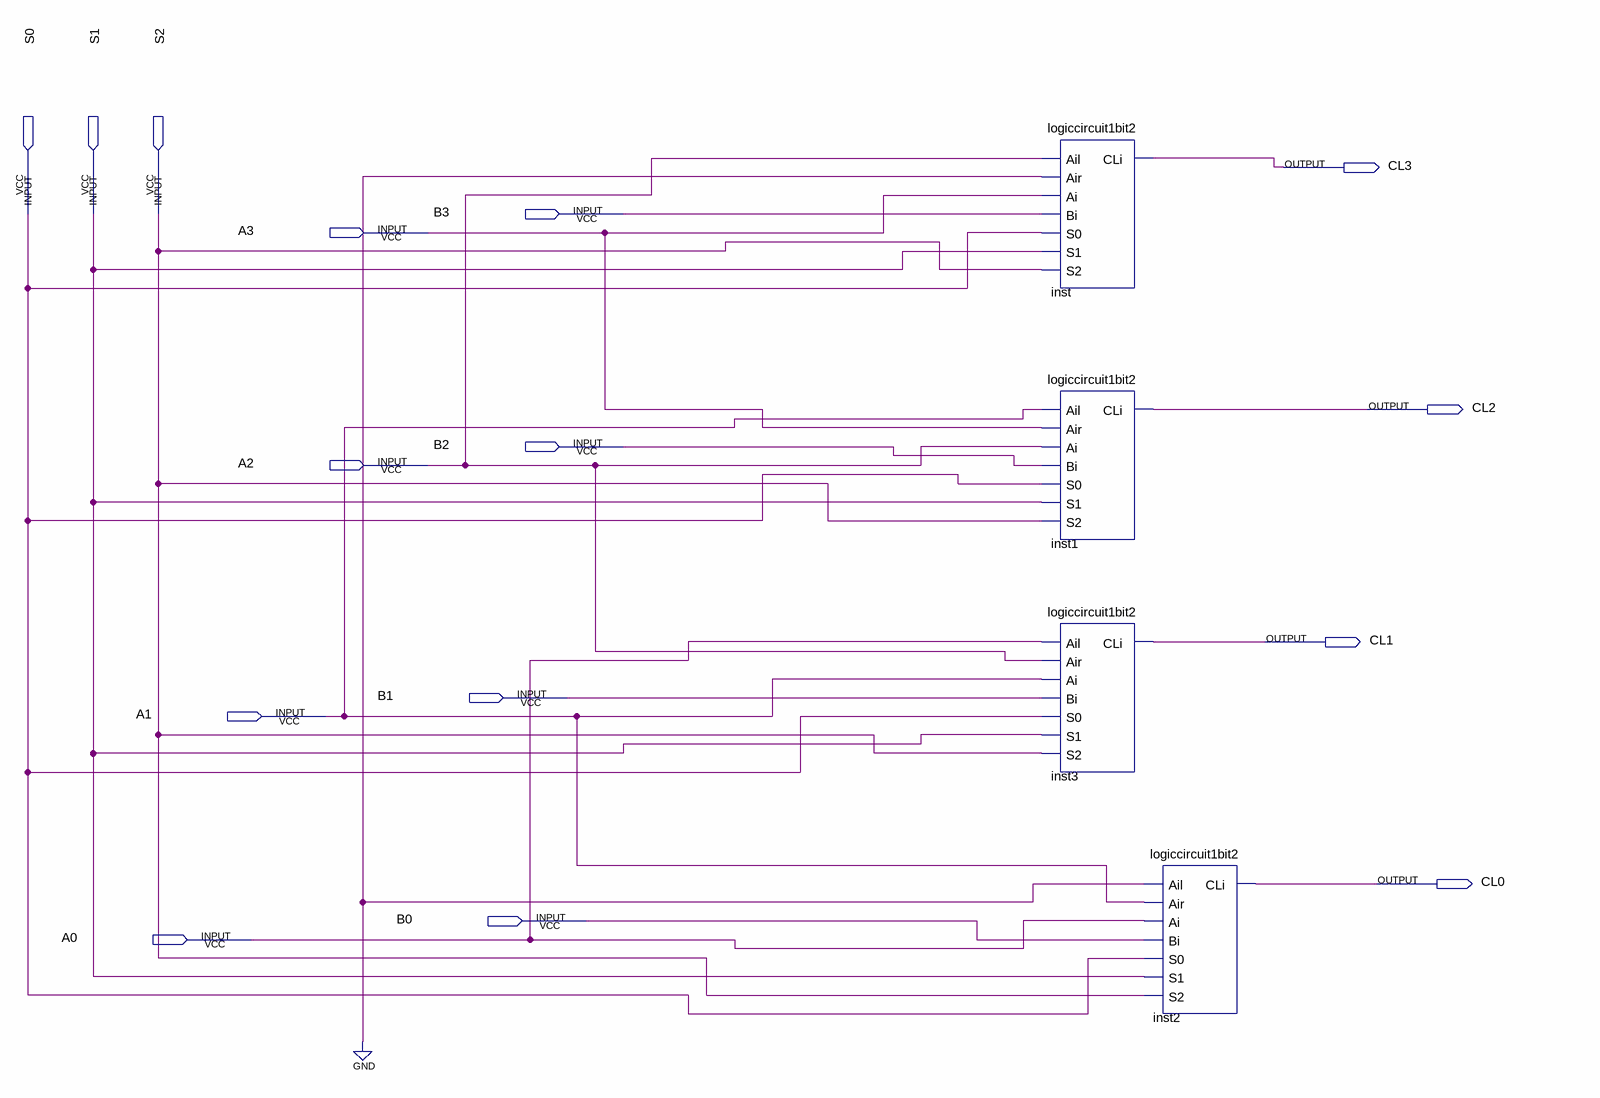
[diagram p0: schematic sheet]
// Quartus schematic logiccircuit4bits.bdf as structural Verilog: 4 symbols, 15 pins
module logiccircuit4bits (
  input  S0,
  input  S1,
  input  S2,
  input  B3,
  input  A3,
  input  B2,
  input  A2,
  input  B1,
  input  A1,
  input  B0,
  input  A0,
  output CL3,
  output CL2,
  output CL1,
  output CL0
);

  logiccircuit1bit2 inst (.Ail(A2), .Air(1'b0), .Ai(A3), .Bi(B3), .S0(S0), .S1(S1), .S2(S2), .CLi(CL3));
  logiccircuit1bit2 inst1 (.Ail(A1), .Air(A3), .Ai(A2), .Bi(B2), .S0(S0), .S1(S1), .S2(S2), .CLi(CL2));
  logiccircuit1bit2 inst3 (.Ail(A0), .Air(A2), .Ai(A1), .Bi(B1), .S0(S0), .S1(S1), .S2(S2), .CLi(CL1));
  logiccircuit1bit2 inst2 (.Ail(1'b0), .Air(A1), .Ai(A0), .Bi(B0), .S0(S0), .S1(S1), .S2(S2), .CLi(CL0));
endmodule
